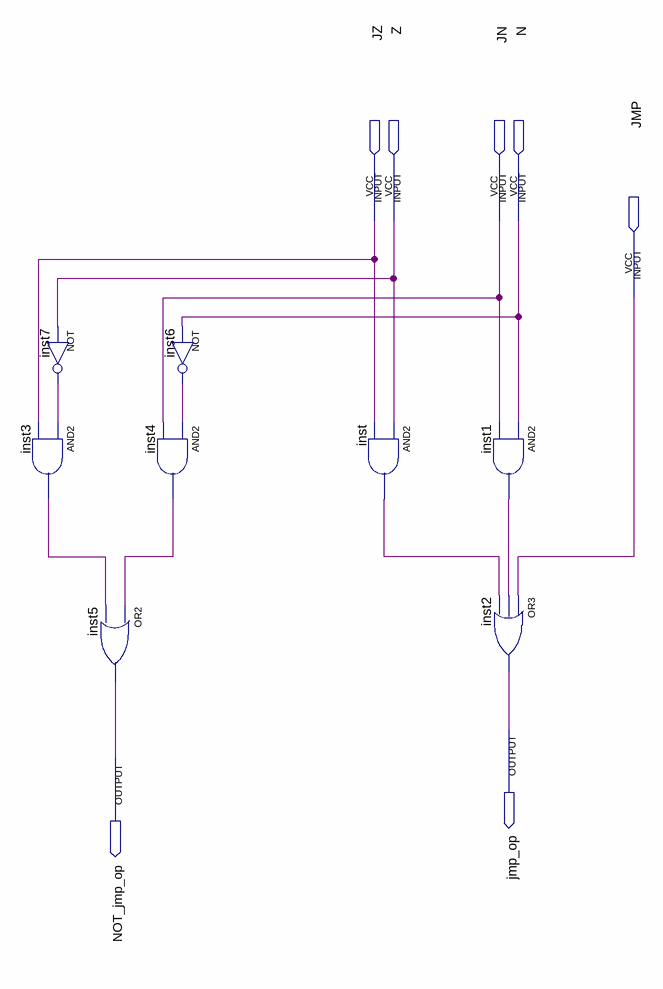
[diagram p0: schematic sheet]
// Quartus schematic uc_jmp_op.bdf as structural Verilog: 8 symbols, 7 pins
module uc_jmp_op (
  input  JZ,
  input  Z,
  input  JN,
  input  N,
  input  JMP,
  output jmp_op,
  output NOT_jmp_op
);

  wire inst1_out, inst3_out, inst4_out, inst6_out, inst7_out, inst_out;

  and inst3 (inst3_out, inst7_out, JZ);
  not inst7 (inst7_out, Z);
  or inst5 (NOT_jmp_op, inst4_out, inst3_out);
  not inst6 (inst6_out, N);
  and inst4 (inst4_out, inst6_out, JN);
  and inst (inst_out, Z, JZ);
  and inst1 (inst1_out, N, JN);
  or inst2 (jmp_op, JMP, inst1_out, inst_out);
endmodule
